# EAGLE schematic MH-ET-Live-MiniKit-RE (EAGLE 9.6.2)
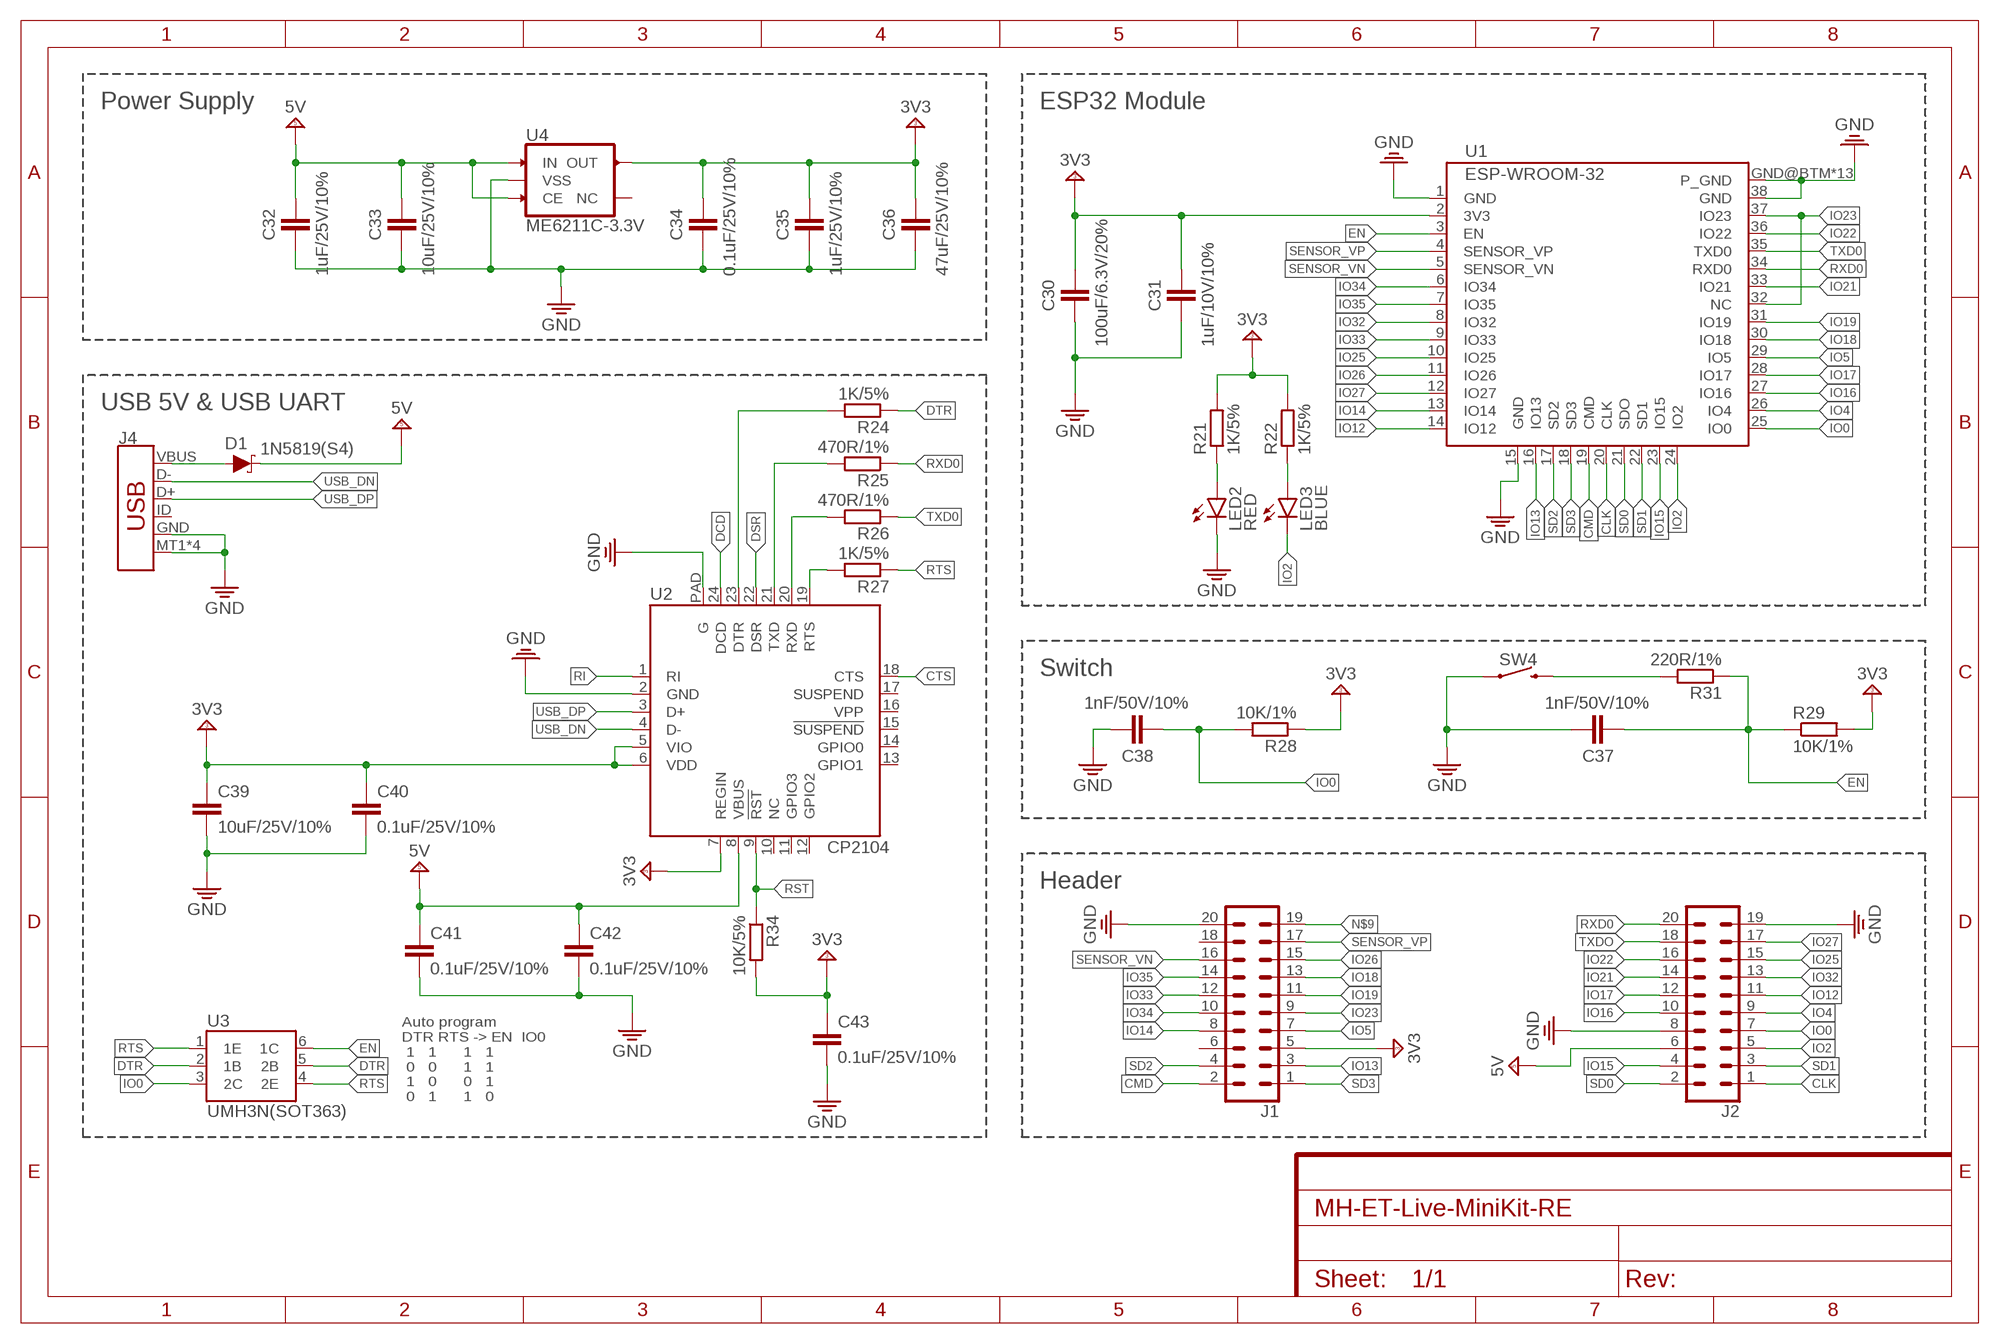
[diagram p0: schematic, sheet 1]

## Parts
C30  100uF/6.3V/20%  C-EUC0402  [C0402]
C31  1uF/10V/10%  C-EUC0402  [C0402]
C32  1uF/25V/10%  C-EUC0402  [C0402]
C33  10uF/25V/10%  C-EUC0402  [C0402]
C34  0.1uF/25V/10%  C-EUC0402  [C0402]
C35  1uF/25V/10%  C-EUC0402  [C0402]
C36  47uF/25V/10%  C-EUC0402  [C0402]
C37  1nF/50V/10%  C-EUC0402  [C0402]
C38  1nF/50V/10%  C-EUC0402  [C0402]
C39  10uF/25V/10%  C-EUC0402  [C0402]
C40  0.1uF/25V/10%  C-EUC0402  [C0402]
C41  0.1uF/25V/10%  C-EUC0402  [C0402]
C42  0.1uF/25V/10%  C-EUC0402  [C0402]
C43  0.1uF/25V/10%  C-EUC0402  [C0402]
D1  1N5819(S4)  DIODE-SCHOTTKY-RB751S40  [SOD-523]
J1  CONN_10X2NOSILK  [2X10-NARROW]
J2  CONN_10X2NOSILK  [2X10-NARROW]
J4  USB_MICRO-B_SMT  [USB-MICROB]
LED2  RED  LEDSML0603  [SML0603]
LED3  BLUE  LEDSML0603  [SML0603]
R21  1K/5%  R-EU_R0402  [R0402]
R22  1K/5%  R-EU_R0402  [R0402]
R24  1K/5%  R-EU_R0402  [R0402]
R25  470R/1%  R-EU_R0402  [R0402]
R26  470R/1%  R-EU_R0402  [R0402]
R27  1K/5%  R-EU_R0402  [R0402]
R28  10K/1%  R-EU_R0402  [R0402]
R29  10K/1%  R-EU_R0402  [R0402]
R31  220R/1%  R-EU_R0402  [R0402]
R34  10K/5%  R-EU_R0402  [R0402]
SW4  MOMENTARY-SWITCH-SPST-SMD-RIGHT-ANGLE  [TACTILE_SWITCH_SMD_RIGHT_ANGLE]
U1  ESP-WROOM-32  [ESP-WROOM-32]
U2  CP2104  [QFN-24]
U3  UMH3N(SOT363)  UMH3NSOT-363  [SOT363_PHILIPS]
U4  ME6211C-3.3V  ME6211-SOT23-5  [SOT23-5]

## Nets
CLK: J2.1 U1.20(CLK)
CMD: J1.2 U1.19(CMD)
CTS: U2.18(CTS)
DCD: U2.24(DCD)
DSR: U2.22(DSR)
DTR: R24.1 U3.2(1B) U3.5(2B)
EN: C37.2 R29.1 R31.1 U1.3(EN) U3.6(1C)
GND: C30.2 C31.2 C32.2 C33.2 C34.2 C35.2 C36.2 C37.1 C38.1 C39.2 C40.2 C41.2 C42.2 C43.2 J1.20 J2.8 J2.19 J4.GND J4.MT1(SHIELD) J4.MT2(SHIELD) J4.P$1(SHIELD) J4.P$2(SHIELD) LED2.C SW4.1 U1.1(GND) U1.15(GND) U1.38(GND) U1.GND@BTM(P_GND) U1.GP01(P_GND) U1.GP02(P_GND) U1.GP03(P_GND) U1.GP04(P_GND) U1.GP05(P_GND) U1.GP06(P_GND) U1.GP07(P_GND) U1.GP08(P_GND) U1.GP09(P_GND) U1.GP10(P_GND) U1.GP11(P_GND) U1.GP12(P_GND) U2.2(GND) U2.PAD(G) U4.2(VSS)
IO0: C38.2 J2.7 R28.2 U1.25(IO0) U3.3(2C)
IO2: J2.5 LED3.C U1.24(IO2)
IO4: J2.9 U1.26(IO4)
IO5: J1.7 U1.29(IO5)
IO12: J2.11 U1.14(IO12)
IO13: J1.3 U1.16(IO13)
IO14: J1.8 U1.13(IO14)
IO15: J2.4 U1.23(IO15)
IO16: J2.10 U1.27(IO16)
IO17: J2.12 U1.28(IO17)
IO18: J1.13 U1.30(IO18)
IO19: J1.11 U1.31(IO19)
IO21: J2.14 U1.33(IO21)
IO22: J2.16 U1.36(IO22)
IO23: J1.9 U1.32(NC) U1.37(IO23)
IO25: J2.15 U1.10(IO25)
IO26: J1.15 U1.11(IO26)
IO27: J2.17 U1.12(IO27)
IO32: J2.13 U1.8(IO32)
IO33: J1.12 U1.9(IO33)
IO34: J1.10 U1.6(IO34)
IO35: J1.14 U1.7(IO35)
N$1: LED2.A R21.1
N$2: LED3.A R22.1
N$3: R31.2 SW4.2
N$4: D1.A J4.VBUS
N$9: J1.19
N$11: R27.2 U2.19(RTS)
N$12: R26.2 U2.20(RXD)
N$13: R25.2 U2.21(TXD)
N$15: R24.2 U2.23(DTR)
RI: U2.1(RI)
RST: R34.1 U2.9(!RST)
RTS: R27.1 U3.1(1E) U3.4(2E)
RXD0: J2.20 R25.1 U1.34(RXD0)
SD0: J2.2 U1.21(SDO)
SD1: J2.3 U1.22(SD1)
SD2: J1.4 U1.17(SD2)
SD3: J1.1 U1.18(SD3)
SENSOR_VN: J1.16 U1.5(SENSOR_VN)
SENSOR_VP: J1.17 U1.4(SENSOR_VP)
TXD0: R26.1 U1.35(TXD0)
TXDO: J2.18
USB_DN: J4.D- U2.4(D-)
USB_DP: J4.D+ U2.3(D+)
VCC: C30.1 C31.1 C32.1 C33.1 C34.1 C35.1 C36.1 C39.1 C40.1 C41.1 C42.1 C43.1 D1.C J1.5 J2.6 R21.2 R22.2 R28.1 R29.2 R34.2 U1.2(3V3) U2.5(VIO) U2.6(VDD) U2.7(REGIN) U2.8(VBUS) U4.1(IN) U4.3(CE) U4.5(OUT) ; supply symbol labelled 3V3, 5V
Unconnected: J1.6 J1.18 J4.ID U2.10(NC) U2.11(GPIO3) U2.12(GPIO2) U2.13(GPIO1) U2.14(GPIO0) U2.15(!SUSPEND) U2.16(VPP) U2.17(SUSPEND) U4.4(NC)

## Notes on the sheet
- Power Supply | ESP32 Module
- USB 5V & USB UART
- Switch
- Header
- Auto program
  DTR RTS -> EN  IO0
   1   1      1   1
   0   0      1   1
   1   0      0   1
   0   1      1   0

## Library data of the parts
C30-C43 = rcl:C-EU: CAPACITOR, European symbol; SPICEPREFIX: C
D1 = SparkFun-DiscreteSemi:DIODE-SCHOTTKY: Schottky diode A Schottky diode is a semiconductor diode which has a low forward voltage drop and a very fast switching action.; PROD_ID: DIO-11018; VALUE: 120mA/40V/370mV
J1 J2 = vinorodrigues-custom-eagle:CONN_10X2: Multi connection point. Often used as Generic Header-pin footprint for 0.1 inch spaced/style header connections On any of the 0.1 inch spaced packages, you can populate with these: Break Away Headers - Straight <https://www.sparkfun.com/products/116> (PRT-00116) Break Away Male Headers - Right Angle <https://www.sparkfun.com/products/553> (PRT-00553) Female Headers <https://www.sparkfun.com/products/115> (PRT-00115) Break Away Headers - Machine Pin <https://www.sparkfun.com/products/117> (PRT-00117) Break Away Female Headers - Swiss Machine Pin <https://www.sparkfun.com/products/743> (PRT-00743) Special note about the "SPECIAL" package: This was SPECIALLY designed to be used with our Graphic LCD Backpack. Be sure you want to use this! It is not only staggered on each line of header holes, but IT IS ALSO offset of the center point of the top and bottom lines by 5 mil. This causes the headers to lock into place on the "standard" footprint on the LCD screen. The extra squares on the tdocu layer are there simply to reference other pins (if you were to actually populate a longer header than ten long - this is what we do with the backpacks).
J4 = SparkFun-Connectors:USB_MICRO-B: USB Type Micro-B Connector Male/female and PTH/SMT variants SparkFun Products: SparkFun microB USB Breakout <https://www.sparkfun.com/products/12035> SparkFun USB microB Plug Breakout <https://www.sparkfun.com/products/10031> SparkFun ESP8266 Thing <https://www.sparkfun.com/products/13231>; PROD_ID: CONN-09505; SF_ID: PRT-08533
LED2 LED3 = led:LED: LED OSRAM: - CHIPLED LG R971, LG N971, LY N971, LG Q971, LY Q971, LO R971, LY R971 LH N974, LH R974 LS Q976, LO Q976, LY Q976 LO Q996 - Hyper CHIPLED LW Q18S LB Q993, LB Q99A, LB R99A - SideLED LS A670, LO A670, LY A670, LG A670, LP A670 LB A673, LV A673, LT A673, LW A673 LH A674 LY A675 LS A676, LA A676, LO A676, LY A676, LW A676 LS A679, LY A679, LG A679 - Hyper Micro SIDELED® LS Y876, LA Y876, LO Y876, LY Y876 LT Y87S - SmartLED LW L88C, LW L88S LB L89C, LB L89S, LG L890 LS L89K, LO L89K, LY L89K LS L896, LA L896, LO L896, LY L896 - TOPLED LS T670, LO T670, LY T670, LG T670, LP T670 LSG T670, LSP T670, LSY T670, LOP T670, LYG T670 LG T671, LOG T671, LSG T671 LB T673, LV T673, LT T673, LW T673 LH T674 LS T676, LA T676, LO T676, LY T676, LB T676, LH T676, LSB T676, LW T676 LB T67C, LV T67C, LT T67C, LS T67K, LO T67K, LY T67K, LW E67C LS E67B, LA E67B, LO E67B, LY E67B, LB E67C, LV E67C, LT E67C LW T67C LS T679, LY T679, LG T679 LS T770, LO T770, LY T770, LG T770, LP T770 LB T773, LV T773, LT T773, LW T773 LH T774 LS E675, LA E675, LY E675, LS T675 LS T776, LA T776, LO T776, LY T776, LB T776 LHGB T686 LT T68C, LB T68C - Hyper Mini TOPLED® LB M676 - Mini TOPLED Santana® LG M470 LS M47K, LO M47K, LY M47K Source: http://www.osram.convergy.de LUXEON: - LUMILED® LXK2-PW12-R00, LXK2-PW12-S00, LXK2-PW14-U00, LXK2-PW14-V00 LXK2-PM12-R00, LXK2-PM12-S00, LXK2-PM14-U00 LXK2-PE12-Q00, LXK2-PE12-R00, LXK2-PE12-S00, LXK2-PE14-T00, LXK2-PE14-U00 LXK2-PB12-K00, LXK2-PB12-L00, LXK2-PB12-M00, LXK2-PB14-N00, LXK2-PB14-P00, LXK2-PB14-Q00 LXK2-PR12-L00, LXK2-PR12-M00, LXK2-PR14-Q00, LXK2-PR14-R00 LXK2-PD12-Q00, LXK2-PD12-R00, LXK2-PD12-S00 LXK2-PH12-R00, LXK2-PH12-S00 LXK2-PL12-P00, LXK2-PL12-Q00, LXK2-PL12-R00 Source: www.luxeon.com KINGBRIGHT: KA-3528ASYC Source: www.kingbright.com
R21 R22 R24-R29 R31 R34 = rcl:R-EU_: RESISTOR, European symbol; SPICEPREFIX: R
SW4 = SparkFun-Switches:MOMENTARY-SWITCH-SPST: Momentary Switch (Pushbutton) - SPST Normally-open (NO) SPST momentary switches (buttons, pushbuttons). Variants PTH-12MM - 12mm square, through-hole Momentary Pushbutton Switch - 12mm Square <https://www.sparkfun.com/products/9190> (COM-09190) PTH-6.0MM, PTH-6.0MM-KIT - 6.0mm square, through-hole Mini Pushbutton Switch <https://www.sparkfun.com/products/97> (COM-00097) KIT package intended for soldering kit's - only one side of pads' copper is exposed. PTH-RIGHT-ANGLE-KIT - Right-angle, through-hole Right Angle Tactile Button <https://www.sparkfun.com/products/10791> - Used on SparkFun BigTime Watch Kit <https://www.sparkfun.com/products/11734> SMD-12MM - 12mm square, surface-mount Tactile Button - SMD (12mm) <https://www.sparkfun.com/products/12993> (COM-12993) Used on SparkFun PicoBoard <https://www.sparkfun.com/products/11888> SMD-4.5MM - 4.5mm Square Trackball Switch Used on SparkFun Blackberry Trackballer Breakout <https://www.sparkfun.com/products/13169> SMD-4.6MMX2.8MM - 4.60mm x 2.80mm, surface mount Used on SparkFun SAMD21 Mini Breakout <https://www.sparkfun.com/products/13664> SMD-5.2MM, SMD-5.2-REDUNDANT - 5.2mm square, surface-mount Mini Pushbutton Switch - SMD <https://www.sparkfun.com/products/8720> (COM-08720) Used on Arduino Pro Mini <https://www.sparkfun.com/products/11114> REDUNDANT package connects both switch circuits together SMD-6.0X3.5MM - 6.0 x 3.5mm, surface mount Momentary Reset Switch SMD <https://www.sparkfun.com/products/8229> (COM-08229) SMD-6.2MM-TALL - 6.2mm square, surface mount Tactile Button - SMD (6mm) <https://www.sparkfun.com/products/12992> Used on SparkFun Digital Sandbox <https://www.sparkfun.com/products/12651> SMD-RIGHT-ANGLE - Right-angle, surface mount Used on SparkFun Block for Intel® Edison - Arduino <https://www.sparkfun.com/products/13036>; PROD_ID: COMP-12265
U1 = vinorodrigues-custom-eagle:ESP-WROOM-32
U2 = vinorodrigues-custom-eagle:CP2104
U3 = vinorodrigues-custom-eagle:UMH3N
U4 = vinorodrigues-custom-eagle:ME6211